# EAGLE schematic Auxillary (EAGLE 6.6.0)
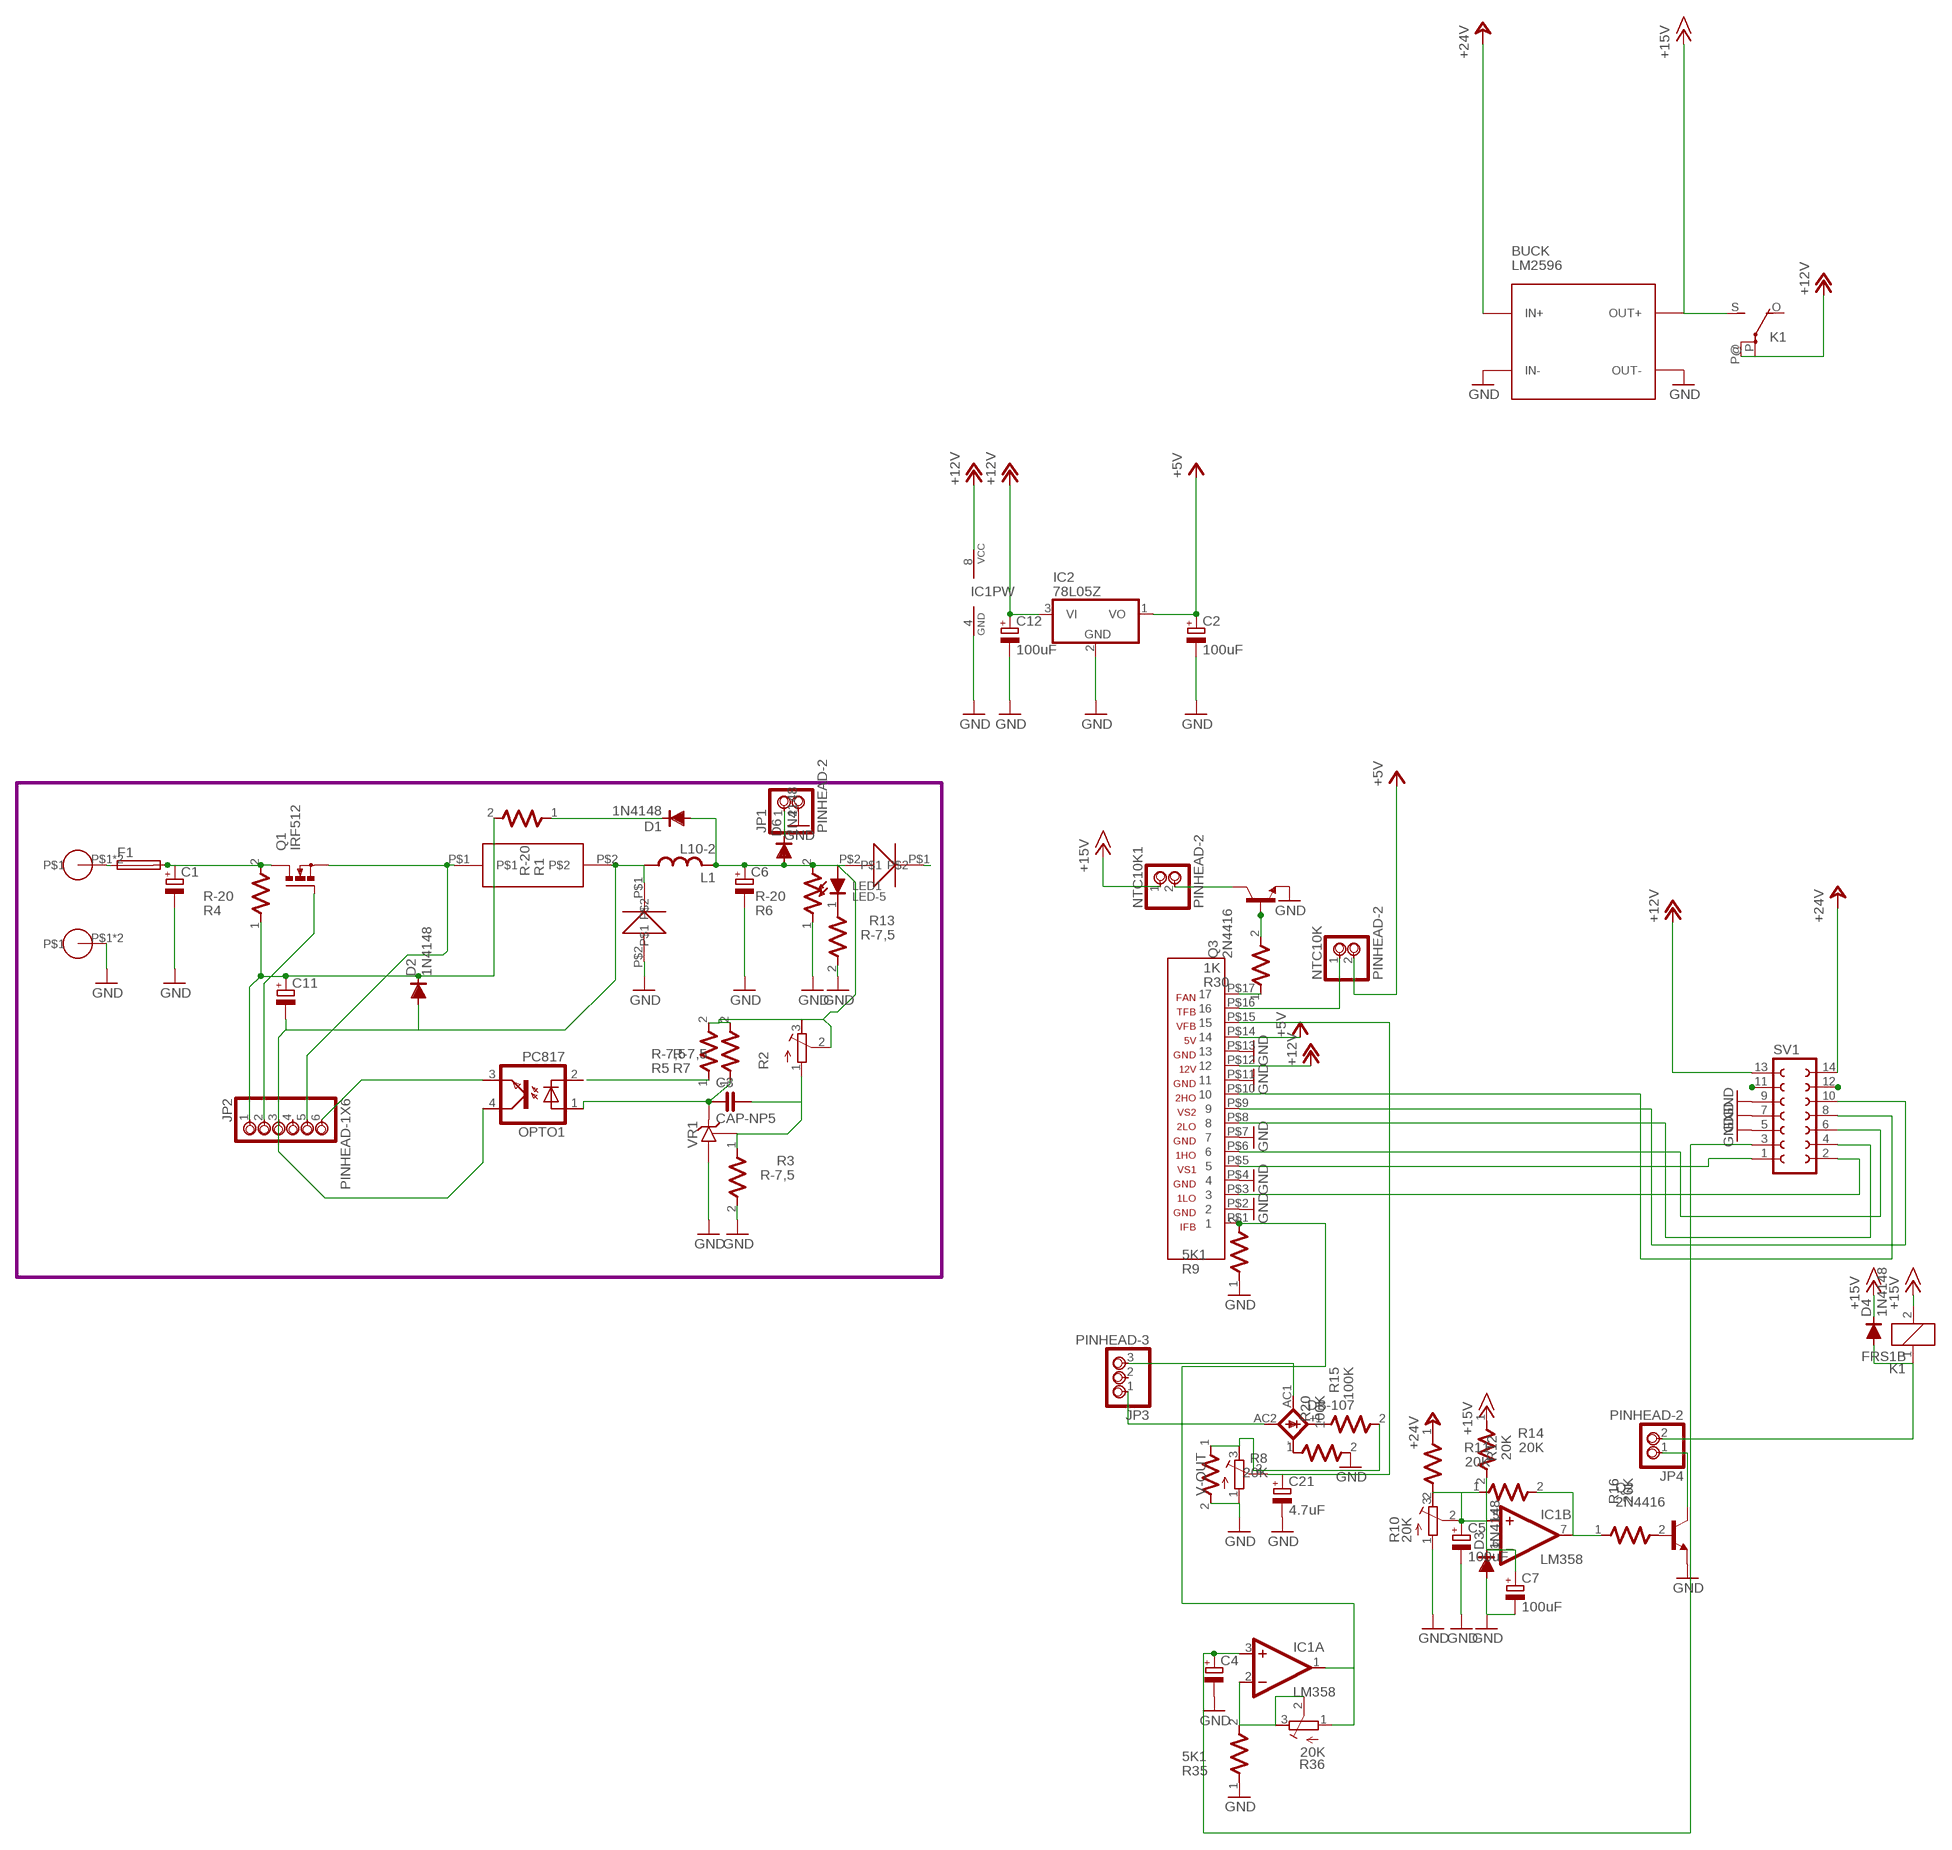
[diagram p0: schematic, sheet 1]

## Parts
BUCK  LM2596  DC-DC-STEP-DOWN-LM2596  [DC-DC-STEP-DOWN-LM2596]
C1  CPOL-EUE7.5-18  [E7,5-18]
C2  100uF  CPOL-EUE2.5-7  [E2,5-7]
C3  CAP-NP5  [CAP-NP5]
C4  CPOL-EUE2.5-7  [E2,5-7]
C5  100uF  CPOL-EUE2.5-7  [E2,5-7]
C6  CPOL-EUE7.5-18  [E7,5-18]
C7  100uF  CPOL-EUE2.5-7  [E2,5-7]
C11  CPOL-EUE5-8.5  [E5-8,5]
C12  100uF  CPOL-EUE2.5-7  [E2,5-7]
C21  4.7uF  CPOL-EUE2.5-7  [E2,5-7]
D1  1N4148  [D-7,5]
D2  1N4148  [D-7,5]
D3  1N4148  [D-7,5]
D4  1N4148  [D-7,5]
D6  1N4148  [D-7,5]
DB-107  CAU-1A  [CAU-1A]
F1  SH22  [SH22]
IC1  LM358  [DIL-8]
IC2  78L05Z  [TO92]
JP1  PINHEAD-2  [PINHEAD-2]
JP2  PINHEAD-1X6  [PINHEAD-1X6]
JP3  PINHEAD-3  [PINHEAD-3]
JP4  PINHEAD-2  [PINHEAD-2]
K1  FRS1B  [FRS1B]
L1  L10-2  [L10-2]
LED1  LED-5  [LED5]
NTC10K  PINHEAD-2  [PINHEAD-2]
NTC10K1  PINHEAD-2  [PINHEAD-2]
OPTO1  PC817  [DIL-04]
Q1  IRF512  [TO220BV]
Q2  2N4416  [TO92]
Q3  2N4416  [TO92]
R1  R-20  [R-20]
R2  R-TRIMM64W  [RTRIM64W]
R3  R-7,5  [R-7,5]
R4  R-20  [R-20]
R5  R-7,5  [R-7,5]
R6  R-20  [R-20]
R7  R-7,5  [R-7,5]
R8  20K  R-7,5  [R-7,5]
R9  5K1  R-7,5  [R-7,5]
R10  20K  R-TRIMM64W  [RTRIM64W]
R11  20K  R-7,5  [R-7,5]
R12  20K  R-7,5  [R-7,5]
R13  R-7,5  [R-7,5]
R14  20K  R-7,5  [R-7,5]
R15  100K  R-7,5  [R-7,5]
R16  20K  R-7,5  [R-7,5]
R20  100K  R-7,5  [R-7,5]
R30  1K  R-7,5  [R-7,5]
R35  5K1  R-7,5  [R-7,5]
R36  20K  R-TRIMM64W  [RTRIM64W]
SV1  FE07-2  [FE07-2]
U$1  DSEI6060A  [DSEI6060A]
U$2  DSEI6060A  [DSEI6060A]
U$3  PIN5MM  [PIN5MM]
U$4  PIN5MM  [PIN5MM]
U$5  SHUNT-0.01R  [SHUNT-0.01R]
U$11  EGS002  [EGS002]
V-OUT  R-TRIMM64W  [RTRIM64W]
VR1  TL431CLP  [TO92-CLP]

## Nets
+5V: C2.+ IC2.1(VO) NTC10K.2 U$11.P$14
+12V: C12.+ IC1.8(PW:VCC) IC2.3(VI) K1.P(2:P) K1.P@(2:P) SV1.13 U$11.P$12
+15V: BUCK.OUT+ D4.C K1.2 K1.S(2:S) NTC10K1.1 R14.1
+24V: BUCK.IN+ R11.1 SV1.14
GND: BUCK.IN- BUCK.OUT- C1.- C2.- C4.- C5.- C6.- C7.- C12.- C21.- D3.A IC1.4(PW:GND) IC2.2(GND) JP1.2 Q2.3(E) Q3.3(E) R3.2 R6.1 R8.2 R9.1 R10.1(A) R13.2 R20.2 R35.1 SV1.5 SV1.7 SV1.9 U$1.P$2 U$3.P$1 U$3.P$2 U$11.P$2 U$11.P$4 U$11.P$7 U$11.P$11 U$11.P$13 V-OUT.1(A) VR1.A
N$1: F1.1 U$4.P$1 U$4.P$2
N$2: C11.- D2.A JP2.3 L1.P$1 L1.P$2 OPTO1.4(COL) U$1.P$1 U$5.P$2
N$3: JP2.2 Q1.G
N$4: D1.C R1.1
N$5: LED1.K R13.1
N$6: C5.+ IC1.5(B:+IN) R10.2(S) R10.3(E) R11.2 R12.1
N$7: JP2.6 OPTO1.3(EMI)
N$8: C4.+ IC1.3(A:+IN) SV1.3
N$9: SV1.11
N$10: C11.+ D2.C JP2.1 R1.2 R4.1
N$11: SV1.12
N$12: C3.2 R2.1(A) R3.1 VR1.R
N$13: SV1.2 U$11.P$3
N$14: JP2.5 Q1.S U$5.P$1
N$15: R5.1
N$16: C1.+ F1.2 Q1.D R4.2
N$17: C3.1 OPTO1.1(A) R7.1 VR1.C
N$18: C6.+ D1.A D6.A L1.P$3 L1.P$4 LED1.A R2.2(S) R2.3(E) R5.2 R6.2 R7.2 U$2.P$2
N$19: R8.1 R15.2 V-OUT.3(E)
N$20: SV1.6 U$11.P$6
N$21: D6.C JP1.1
N$22: SV1.4 U$11.P$8
N$23: IC1.2(A:-IN) R35.2 R36.2(S) R36.3(E)
N$24: SV1.10 U$11.P$9
N$25: SV1.8 U$11.P$10
N$26: R30.1 U$11.P$17
N$27: DB-107.AC2(-) JP3.1
N$28: IC1.7(B:OUT) R12.2 R16.1
N$29: C7.+ D3.C IC1.6(B:-IN) R14.2
N$31: Q2.2(B) R16.2
N$32: JP4.1 Q2.1(C)
N$33: D4.A JP4.2 K1.1
N$35: SV1.1 U$11.P$5
N$37: Q3.2(B) R30.2
N$40: C21.+ U$11.P$15 V-OUT.2(S)
N$41: NTC10K1.2 Q3.1(C)
N$45: DB-107.+ R15.1
N$47: DB-107.-(AC2) R20.1
N$48: NTC10K.1 U$11.P$16
N$51: IC1.1(A:OUT) R9.2 R36.1(A) U$11.P$1
N$53: DB-107.AC1 JP3.3
VCC: U$2.P$1
Unconnected: JP2.4 JP3.2 K1.O(2:O) OPTO1.2(C)

## Library data of the parts
BUCK = diy-modules:DC-DC-STEP-DOWN-LM2596: DC/DC Step-Down Regulator based on LM2596-ADJ chip LM2596 datasheet available here: http://www.ti.com/lit/ds/symlink/lm2596.pdf Click here to find device on ebay.com <http://www.ebay.com/sch/lm2596+power+regulator>
C1 C2 C4-C7 C11 C12 C21 = LBR inverter true sine:CPOL-EU: POLARIZED CAPACITOR, European symbol
C3 = chuong:CAP-NP5
D1-D4 D6 = chuong:1N4148
DB-107 = lbr:CAU-1A
F1 = fuse:SH22: FUSE HOLDER CS PFP30, Schukat; OC_FARNELL: unknown; OC_NEWARK: unknown
IC1 = LBR inverter true sine:LM358
IC2 = chuong:78*: Positive VOLTAGE REGULATOR Source: http://cache.national.com/ds/LM/LM78L05.pdf http://www.fairchildsemi.com/ds/LM/LM7805.pdf
JP1 JP4 = chuong:PINHEAD-2
JP2 = chuong:PINHEAD-1X6
JP3 = chuong:PINHEAD-3
K1 = relay:FRS1B: RELAY 1 x switch, same as V23101-D6-A201, Siemens; OC_FARNELL: unknown; OC_NEWARK: unknown
L1 = lbr:L10-2
LED1 = chuong:LED-5
NTC10K NTC10K1 = LBR inverter true sine:PINHEAD-2
OPTO1 = chuong:PC817
Q1 = LBR inverter true sine:IRF512: N-CHANNEL MOS FET
Q2 Q3 = lbr:2N4416: NPN Transistor
R1 R4 R6 = chuong:R-20
R2 R10 R36 V-OUT = chuong:R-TRIMM: Trimm resistor
R3 R5 R7-R9 R11-R16 R20 R30 R35 = chuong:R-7,5
SV1 = con-lsta:FE07-2: FEMALE HEADER; OC_FARNELL: unknown; OC_NEWARK: unknown
U$1 U$2 = LBR-NEW:DSEI6060A
U$3 U$4 = LBR inverter true sine:PIN5MM
U$5 = Shunt 0.01R:SHUNT-0.01R
U$11 = LBR inverter true sine:EGS002
VR1 = chuong:TL431CLP: VOLTAGE REGULATOR